# Altium schematic sheet afe.SchDoc: AFE
size A4; Author: Samuel López; DocumentNumber: 3; SheetNumber: 3; SheetTotal: 6
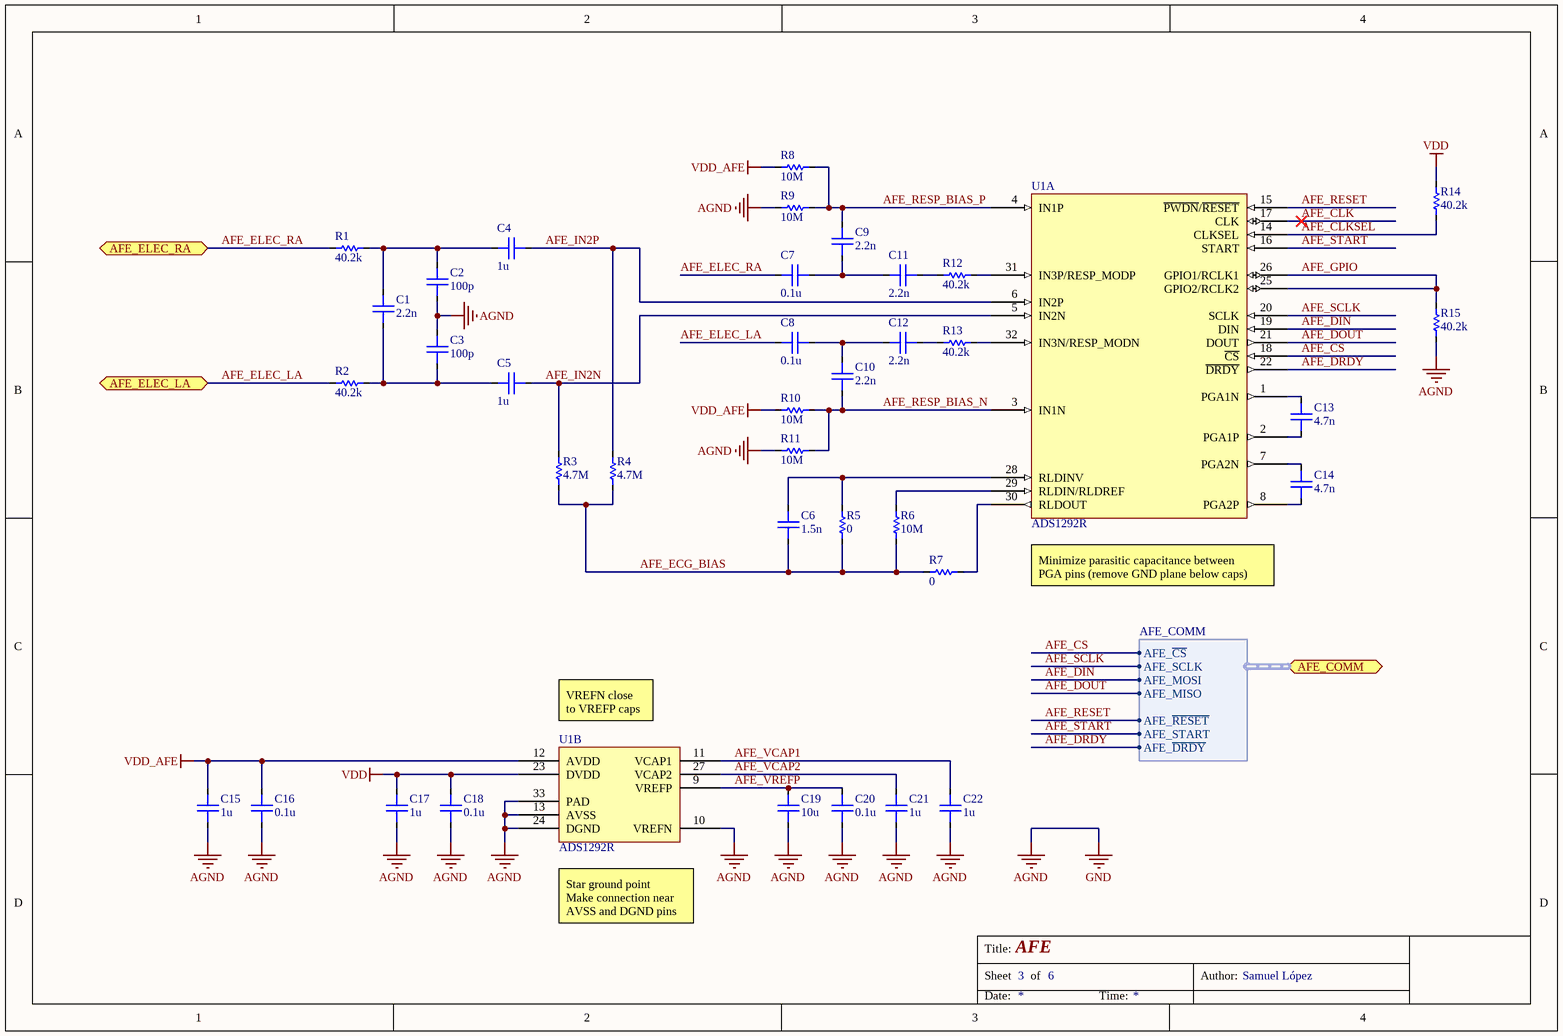
[diagram p0: afe.SchDoc]

## Parts
C1  2.2n  [C0402]
C2  100p  [C0402]
C3  100p  [C0402]
C4  1u  [C0402]
C5  1u  [C0402]
C6  1.5n  [C0402]
C7  0.1u  [C0402]
C8  0.1u  [C0402]
C9  2.2n  [C0402]
C10  2.2n  [C0402]
C11  2.2n  [C0402]
C12  2.2n  [C0402]
C13  4.7n  [C0402]
C14  4.7n  [C0402]
C15  1u  [C0402]
C16  0.1u  [C0402]
C17  1u  [C0402]
C18  0.1u  [C0402]
C19  10u  [C0603]
C20  0.1u  [C0402]
C21  1u  [C0402]
C22  1u  [C0402]
R1  40.2k  [R0402]
R2  40.2k  [R0402]
R3  4.7M  [R0402]
R4  4.7M  [R0402]
R5  0  [R0402]
R6  10M  [R0402]
R7  0  [R0402]
R8  10M  [R0402]
R9  10M  [R0402]
R10  10M  [R0402]
R11  10M  [R0402]
R12  40.2k  [R0402]
R13  40.2k  [R0402]
R14  40.2k  [R0402]
R15  40.2k  [R0402]
U1  ADS1292R  [ADS129x_QFN]  (parts A,B of 2)

## Ports
AFE_COMM (harness AFE_COMM), AFE_ELEC_LA (bidir), AFE_ELEC_RA (bidir)

## Harnesses
AFE_COMM: AFE_SCLK, AFE_MOSI, AFE_MISO, AFE_~{CS}, AFE_~{RESET}, AFE_START, AFE_~{DRDY}

## Nets
AGND: C2.2 C3.1 C15.1 C16.1 C17.1 C18.1 C19.1 C20.1 C21.1 C22.1 R9.2 R11.2 R15.1 U1.10(VREFN) U1.13(AVSS) U1.24(DGND) U1.33(PAD)  [also labelled GND]
VDD: C17.2 C18.2 R14.2 U1.23(DVDD)
VDD_AFE: C15.2 C16.2 R8.2 R10.2 U1.12(AVDD)
AFE_CLK: U1.17(CLK)
AFE_CLKSEL: R14.1 U1.14(CLKSEL)
AFE_CS: U1.18(~{CS}) ; port AFE_COMM.AFE_~{CS}
AFE_DIN: U1.19(DIN) ; port AFE_COMM.AFE_MOSI
AFE_DOUT: U1.21(DOUT) ; port AFE_COMM.AFE_MISO
AFE_DRDY: U1.22(~{DRDY}) ; port AFE_COMM.AFE_~{DRDY}
AFE_ECG_BIAS: C6.1 R3.1 R4.1 R5.1 R6.1 R7.2
AFE_ELEC_LA: C8.1 R2.2 ; port AFE_ELEC_LA
AFE_ELEC_RA: C7.2 R1.2 ; port AFE_ELEC_RA
AFE_GPIO: R15.2 U1.25(GPIO2/RCLK2) U1.26(GPIO1/RCLK1)
AFE_IN2N: C5.2 R3.2 U1.5(IN2N)
AFE_IN2P: C4.2 R4.2 U1.6(IN2P)
AFE_RESET: U1.15(~{PWDN}/~{RESET}) ; port AFE_COMM.AFE_~{RESET}
AFE_RESP_BIAS_N: C10.1 R10.1 R11.1 U1.3(IN1N)
AFE_RESP_BIAS_P: C9.1 R8.1 R9.1 U1.4(IN1P)
AFE_SCLK: U1.20(SCLK) ; port AFE_COMM.AFE_SCLK
AFE_START: U1.16(START) ; port AFE_COMM.AFE_START
AFE_VCAP1: C22.2 U1.11(VCAP1)
AFE_VCAP2: C21.2 U1.27(VCAP2)
AFE_VREFP: C19.2 C20.2 U1.9(VREFP)
NetC1_1: C1.1 C2.1 C4.1 R1.1
NetC1_2: C1.2 C3.2 C5.1 R2.1
NetC6_2: C6.2 R5.2 U1.28(RLDINV)
NetC7_1: C7.1 C9.2 C11.2
NetC8_2: C8.2 C10.2 C12.1
NetC11_1: C11.1 R12.2
NetC12_2: C12.2 R13.2
NetC13_1: C13.1 U1.2(PGA1P)
NetC13_2: C13.2 U1.1(PGA1N)
NetC14_1: C14.1 U1.8(PGA2P)
NetC14_2: C14.2 U1.7(PGA2N)
NetR6_2: R6.2 U1.29(RLDIN/RLDREF)
NetR7_1: R7.1 U1.30(RLDOUT)
NetR12_1: R12.1 U1.31(IN3P/RESP_MODP)
NetR13_1: R13.1 U1.32(IN3N/RESP_MODN)

## Notes on the sheet
- Minimize parasitic capacitance between
  PGA pins (remove GND plane below caps)
- (near U1) VREFN close
  to VREFP caps
- (near U1) Star ground point
  Make connection near AVSS and DGND pins
- Title:
- Sheet
- of
- Author:
- Date:
- Time:

## Library data of the parts
C1-C22 = Capacitor: Rated Voltage: *
  C1 C9-C12: Value: 2.2n
  C2 C3: Value: 100p
  C4 C5 C15 C17 C21 C22: Value: 1u
  C6: Value: 1.5n
  C7 C8 C16 C18 C20: Value: 0.1u
  C13 C14: Value: 4.7n
  C19: Value: 10u
R1-R15 = Resistor: Power: *
  R1 R2 R12-R15: Value: 40.2k
  R3 R4: Value: 4.7M
  R5 R7: Value: 0
  R6 R8-R11: Value: 10M
U1 = ADS1292R: IC - Analog Front End - Medical; Supplier 1: Digi-Key; Supplier Part Number 1: 296-35020-1-ND